# Altium schematic sheet AIL_2_Schem.SchDoc
size A4; SheetNumber: 2; SheetTotal: 2
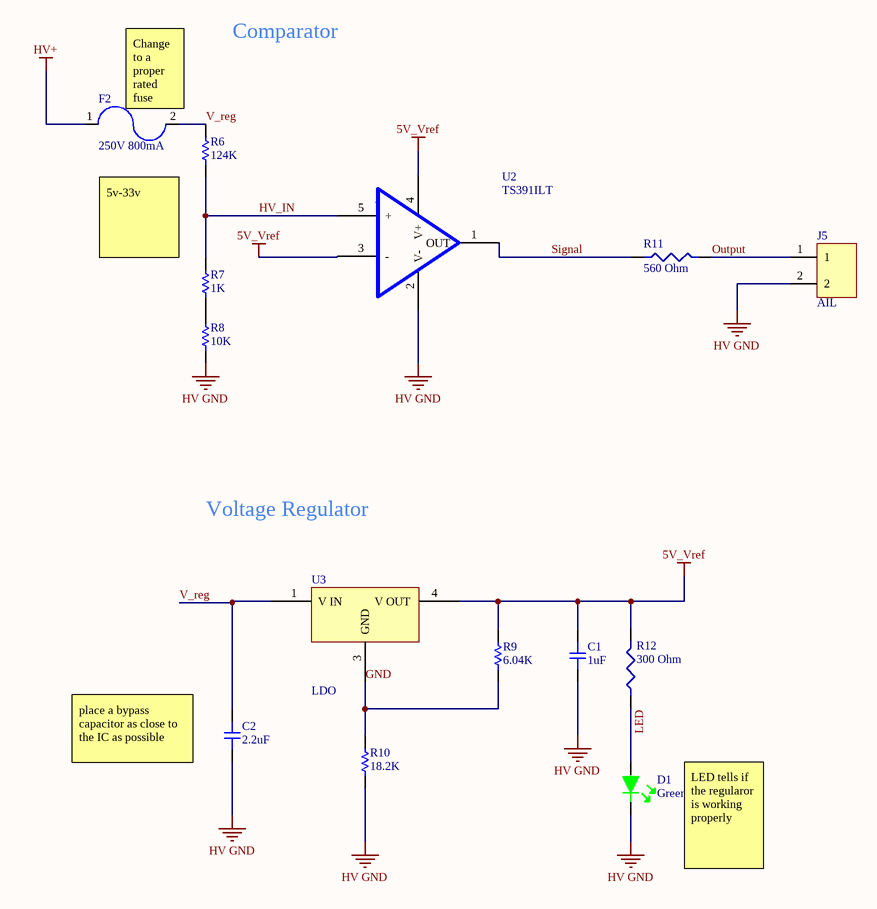
[diagram p0: AIL_2_Schem.SchDoc]

## Parts
C1  1uF  [CAP-0603]
C2  2.2uF  [CAP-2220]
D1  Green  [LED-0603]
F2  250V 800mA  [FUSE_SMD]
J5  AIL  [2PIN]
R6  124K  [RES-0603]
R7  1K  [RES-0603]
R8  10K  [RES-0603]
R9  6.04K  [RES-0603]
R10  18.2K  [RES-0603]
R11  560 Ohm  [RESC2012X06N]
R12  300 Ohm  [RESC1608X06N]
U2  TS391ILT  [SOT95P280X145-5N]
U3  LDO  [DPAK228P998X235-3N]

## Nets
5V_Vref: C1.2 R9.2 R12.2 U2.3(-) U2.4(V+) U3.4(V_OUT)
HV GND: C1.1 C2.1 D1.2 J5.2 R8.1 R10.1 U2.2(V-)
HV+: F2.1
GND: R9.1 R10.2 U3.3(GND)
HV_IN: R6.1 R7.2 U2.5(+)
LED: D1.1 R12.1
Output: J5.1 R11.2
Signal: R11.1 U2.1(OUT)
V_reg: C2.2 F2.2 R6.2 U3.1(V_IN)
NetR7_1: R7.1 R8.2

## Notes on the sheet
- Comparator
- (near F2) Change to a proper rated fuse
- 5v-33v
- Voltage Regulator
- (near C2) place a bypass capacitor as close to the IC as possible
- (near D1) LED tells if the regularor is working properly

## Library data of the parts
C1 = 0603-1uF-16V: CAP CER 1UF 16V X7R 0603; Manufacturer: KEMET; Manufacturer Part Number: C0603C105K4RACTU; Dielectric Material: Ceramic; Tolerance: 10%; Dissipation Factor: 3.5%; Supplier 1: Digi-Key; Stock 1: 600463; Pricing 1: 1=0.12, 10=0.088, 100=0.0391, 500=0.02792, 1000=0.02193 (USD); Mount: Surface Mount,PCB; Case/Package: 0603; Number of Pins: 2; Case Code (Metric): 1608; Case Code (Imperial): 0603; Contact Plating: Tin,Matte; Min Operating Temperature: -55°C; Max Operating Temperature: 125°C; Package Quantity: 4000; Capacitance: 1uF; Voltage Rating: 16V; Packaging: Tape and Reel; Voltage Rating (DC): 16V; Dielectric: X7R; Termination: SMD/SMT; Voltage: 16V; Length: 1.6mm; Height: 0.8mm; Width: 0.031inch; Thickness: 0.034inch; Depth: 0.8mm; Radiation Hardening: No; REACH SVHC: No SVHC; ComponentLink1URL: http://www.mouser.com/ds/2/212/KEM_C1002_X7R_SMD-1102033.pdf?src-supplier=Mouser; ComponentLink1Description: http://www.mouser.com/ds/2/212/KEM_C1002_X7R_SMD-1102033.pdf?src-supplier=Mouser; ComponentLink2URL: http://www.kemet.com/kemet/web/homepage/kechome.nsf/file/Commercial%20Ceramic%20Chips%20X7R%20Dielectric/$file/KEM_C1002_X7R_SMD.pdf?src-supplier=Element14; ComponentLink2Description: http://www.kemet.com/kemet/web/homepage/kechome.nsf/file/Commercial%20Ceramic%20Chips%20X7R%20Dielectric/$file/KEM_C1002_X7R_SMD.pdf?src-supplier=Element14; ComponentLink3URL: https://www.verical.com/server-webapp/html/getDatasheet?partID=385479&src-supplier=Verical; ComponentLink3Description: https://www.verical.com/server-webapp/html/getDatasheet?partID=385479&src-supplier=Verical; ComponentLink4URL: http://www.kemet.com/kemet/web/homepage/kechome.nsf/vapubfiles/KEM_C1002_X7R_SMD.pdf/$file/KEM_C1002_X7R_SMD.pdf?src-supplier=Element14; ComponentLink4Description: http://www.kemet.com/kemet/web/homepage/kechome.nsf/vapubfiles/KEM_C1002_X7R_SMD.pdf/$file/KEM_C1002_X7R_SMD.pdf?src-supplier=Element14; Supplier Part Number 1: 399-7847-6-ND
C2 = 2220-2.2uF-450V: CAP CER 2.2UF 450V X6S 2220; Manufacturer: TDK; Manufacturer Part Number: C5750X6S2W225K250KA; Tolerance: 10%; Supplier 1: Digi-Key; Stock 1: 8149; Pricing 1: 1=3.66, 10=2.957, 100=2.258 (USD); Mount: Surface Mount; Case/Package: 2220; Weight: 0.016932oz; Case Code (Metric): 5750; Case Code (Imperial): 2220; Min Operating Temperature: -55°C; Max Operating Temperature: 105°C; Package Quantity: 1; Capacitance: 2.2uF; Voltage Rating: 450V; Packaging: Tape and Reel; Dielectric: X6S; Termination: SMD/SMT; Voltage Rating (DC): 450V; Length: 5.7mm; Height: 2.5mm; Width: 0.197inch; Thickness: 0.11inch; Depth: 5mm; Radiation Hardening: No; REACH SVHC: No SVHC; Lead Free: Lead Free; ComponentLink1URL: http://product.tdk.com/capacitor/mlcc/en/documents/mlcc_commercial_midvoltage_en.pdf?src-supplier=Avnet+Europe; ComponentLink1Description: http://product.tdk.com/capacitor/mlcc/en/documents/mlcc_commercial_midvoltage_en.pdf?src-supplier=Avnet+Europe; Supplier Part Number 1: 445-7781-6-ND
D1 = LED-Green: LED GREEN CLEAR 0603 SMD; Manufacturer: Wurth Electronics; Manufacturer Part Number: 150060VS75000; Luminous Intensity: 40mcd; Viewing Angle: 140°; Forward Voltage: 2V; Wavelength: 570nm; Lens Style: Clear,Rectangular; Forward Current: 30mA; Test Current: 20mA; Supplier 1: Digi-Key; Stock 1: 118118; Pricing 1: 1=0.14, 50=0.133, 100=0.114, 500=0.099 (USD); Mount: Surface Mount; Case/Package: 0603; Number of Pins: 2; Color: Green; Case Code (Metric): 1608; Case Code (Imperial): 0603; Min Operating Temperature: -40°C; Max Operating Temperature: 85°C; Package Quantity: 1; Packaging: Tape and Reel; Dominant Wavelength: 570nm; Length: 1.6mm; Height: 0.7mm; Width: 0.8mm; REACH SVHC: Unknown; ComponentLink1URL: https://katalog.we-online.de/led/datasheet/150060VS75000.pdf?src-supplier=Digi-Key; ComponentLink1Description: https://katalog.we-online.de/led/datasheet/150060VS75000.pdf?src-supplier=Digi-Key; Supplier Part Number 1: 732-4980-1-ND
F2 = 0678D0800-02: Manufacturer: Bel; Fuse Type: Board Mount (Cartridge Style Excluded); Voltage Rating (AC): 350V; DC Cold Resistance: 380mR; Approvals: cURus; Supplier 1: Digi-Key; Manufacturer Part Number: 0678D0800-02; Stock 1: 2000; Pricing 1: 1=1.2, 5=1.164, 10=1.089, 50=0.901, 100=0.7508, 250=0.732, 500=0.61936, 1000=0.54429 (USD); Mount: Surface Mount; Case/Package: SMD/SMT; Min Operating Temperature: -55°C; Max Operating Temperature: 125°C; Packaging: Tape and Reel; Current Rating: 800mA; Voltage Rating (DC): 250V; Supplier Part Number 1: 507-2258-6-ND
J5 = 2PIN: CONN HEADER R/A 2POS 2.54MM; Manufacturer: Molex; Manufacturer Part Number: 0705530106; Number of Positions: 2; Contact Resistance: 30mR; Connector Type: Male Pin; Supplier 1: Digi-Key; Stock 1: 2224; Pricing 1: 1=1.38, 10=1.25, 100=1.071, 500=0.8925, 1000=0.765, 5000=0.6783, 10000=0.663 (USD); Mount: Through Hole; Housing Material: Polyester; Contact Plating: Gold; Contact Material: Bronze; Color: Black; Housing Color: Black; Min Operating Temperature: -40°C; Max Operating Temperature: 105°C; Number of Rows: 1; Packaging: Rail/Tube; Termination: Solder; Number of Contacts: 2; Orientation: Right Angle; Length: 7.37mm; Pitch: 2.54mm; Depth: 13.59mm; Contact Mating Length: 0.24inch; ComponentLink1URL: http://www.molex.com/webdocs/datasheets/pdf/en-us/0705530106_PCB_HEADERS.pdf?src-supplier=Avnet+Asia; ComponentLink1Description: http://www.molex.com/webdocs/datasheets/pdf/en-us/0705530106_PCB_HEADERS.pdf?src-supplier=Avnet+Asia; ComponentLink2URL: https://www.molex.com/pdm_docs/ps/PS-70400.pdf?src-supplier=Digi-Key; ComponentLink2Description: https://www.molex.com/pdm_docs/ps/PS-70400.pdf?src-supplier=Digi-Key; Supplier Part Number 1: WM4153-ND
R6 = 0603-124KR: RES 124K OHM 1% 1/10W 0603; Manufacturer: Stackpole Electronics; Manufacturer Part Number: RMCF0603FT124K; Resistance: 124kR; Max Power Dissipation: 100mW; Temperature Coefficient: 100ppm/°C; Supplier 1: Digi-Key; Stock 1: 39767; Pricing 1: 1=0.1, 10=0.016, 100=0.0065, 1000=0.00292, 2500=0.00253 (USD); Mount: Surface Mount; Case/Package: 0603; Case Code (Metric): 1608; Case Code (Imperial): 0603; Contact Plating: Tin,Matte; Min Operating Temperature: -55°C; Max Operating Temperature: 155°C; Tolerance: 1%; Packaging: Tape and Reel; Composition: Thick Film; Number of Terminations: 2; Military Standard: Not; Features: Automotive AEC-Q200; Length: 0.061inch; Height: 0.022inch; Width: 0.031inch; Depth: 0.8mm; Radiation Hardening: No; ComponentLink1URL: https://www.seielect.com/Catalog/SEI-RMCF_RMCP.pdf?src-supplier=Digi-Key; ComponentLink1Description: https://www.seielect.com/Catalog/SEI-RMCF_RMCP.pdf?src-supplier=Digi-Key; ComponentLink2URL: https://www.seielect.com/catalog/SEI-Packaging.pdf?src-supplier=Digi-Key; ComponentLink2Description: https://www.seielect.com/catalog/SEI-Packaging.pdf?src-supplier=Digi-Key; ComponentLink3URL: https://www.verical.com/server-webapp/html/getDatasheet?partID=371756&src-supplier=Verical; ComponentLink3Description: https://www.verical.com/server-webapp/html/getDatasheet?partID=371756&src-supplier=Verical; ComponentLink4URL: http://components.arrow.com/part/dataview/40961222S9798425N1174?src-supplier=Arrow; ComponentLink4Description: http://components.arrow.com/part/dataview/40961222S9798425N1174?src-supplier=Arrow; ComponentLink5URL: https://www.seielect.com/catalog/SEI-RMCF_RMCP.pdf?src-supplier=Avnet; ComponentLink5Description: https://www.seielect.com/catalog/SEI-RMCF_RMCP.pdf?src-supplier=Avnet; Supplier Part Number 1: RMCF0603FT124KDKR-ND
R7 = 0603-1KR: RES SMD 1K OHM 1% 1/10W 0603; Manufacturer: Vishay Dale; Manufacturer Part Number: CRCW06031K00FKEA; Resistance: 1kR; Power Rating: 100mW; Voltage Rating: 75V; Temperature Coefficient: 100ppm/°C; Supplier 1: Digi-Key; Stock 1: 671453; Pricing 1: 1=0.1, 10=0.034, 100=0.0139, 1000=0.00623, 2500=0.0054 (USD); Mount: Surface Mount; Case/Package: 0603; Number of Pins: 2; Weight: 7.1E-05oz; Case Code (Metric): 1608; Case Code (Imperial): 0603; Contact Plating: Tin; Min Operating Temperature: -55°C; Max Operating Temperature: 155°C; Composition: Thick Film; Tolerance: 1%; Packaging: Tape and Reel; Package Quantity: 10; Number of Terminations: 2; Termination: SMD/SMT; Military Standard: Not; Max Power Dissipation: 100mW; Voltage Rating (DC): 75V; Features: Automotive AEC-Q200; Length: 1.55mm; Height: 0.45mm; Width: 0.033inch; Depth: 0.85mm; Radiation Hardening: No; REACH SVHC: Unknown; Lead Free: Lead Free; ComponentLink1URL: http://www.vishay.com/docs/20035/dcrcwe3.pdf?src-supplier=Digi-Key; ComponentLink1Description: http://www.vishay.com/docs/20035/dcrcwe3.pdf?src-supplier=Digi-Key; ComponentLink2URL: http://uk.rs-online.com/webdocs/0d98/0900766b80d98afc.pdf?src-supplier=RSComponents; ComponentLink2Description: http://uk.rs-online.com/webdocs/0d98/0900766b80d98afc.pdf?src-supplier=RSComponents; ComponentLink3URL: http://www.vishay.com/docs/20035/dcrcwe3.pdf?src-supplier=Avnet; ComponentLink3Description: http://www.vishay.com/docs/20035/dcrcwe3.pdf?src-supplier=Avnet; ComponentLink4URL: http://www.vishay.com/docs/20035/dcrcwe3.pdf?src-supplier=Avnet+Asia; ComponentLink4Description: http://www.vishay.com/docs/20035/dcrcwe3.pdf?src-supplier=Avnet+Asia; ComponentLink5URL: http://www.farnell.com/datasheets/2310790.pdf?src-supplier=Element14; ComponentLink5Description: http://www.farnell.com/datasheets/2310790.pdf?src-supplier=Element14; ComponentLink6URL: https://www.distrelec.biz/Web/Downloads/a_/en/flD-CRCW-e3_data_en.pdf?mime=application%2Fpdf&src-supplier=Distrelec; ComponentLink6Description: https://www.distrelec.biz/Web/Downloads/a_/en/flD-CRCW-e3_data_en.pdf?mime=application%2Fpdf&src-supplier=Distrelec; ComponentLink7URL: http://www.vishay.com/docs/20035/dcrcwe3.pdf?src-supplier=Future+Electronics; ComponentLink7Description: http://www.vishay.com/docs/20035/dcrcwe3.pdf?src-supplier=Future+Electronics; ComponentLink8URL: http://www.vishay.com/docs/20035/dcrcwe3.pdf?src-supplier=Avnet+Europe; ComponentLink8Description: http://www.vishay.com/docs/20035/dcrcwe3.pdf?src-supplier=Avnet+Europe; Supplier Part Number 1: 541-1.00KHCT-ND
R8 = 0603-10KR: RES SMD 10K OHM 5% 1/10W 0603; Manufacturer: Yageo; Manufacturer Part Number: RC0603JR-0710KL; Resistance: 10kR; Voltage Rating (DC): 50V; Temperature Coefficient: 100ppm/°C; Power Rating: 100mW; Supplier 1: Digi-Key; Stock 1: 3006558; Pricing 1: 1=0.1, 10=0.019, 100=0.0077, 1000=0.00347, 2500=0.00301 (USD); Case/Package: 0603; Number of Pins: 2; Contact Plating: Tin,Matte; Case Code (Imperial): 0603; Case Code (Metric): 1608; Min Operating Temperature: -55°C; Max Operating Temperature: 155°C; Packaging: Tape and Reel; Tolerance: 5%; Composition: Thick Film; Voltage Rating: 50V; Termination: SMD/SMT; Military Standard: Not; Features: Moisture Resistant; Max Power Dissipation: 100mW; Number of Terminations: 2; Length: 0.063inch; Width: 0.031inch; Depth: 0.8mm; Height - Seated (Max): 0.022inch; Radiation Hardening: No; REACH SVHC: Unknown; Lead Free: Lead Free; ComponentLink1URL: http://www.yageo.com/documents/recent/PYu-RC_Group_51_RoHS_L_10.pdf?src-supplier=Digi-Key; ComponentLink1Description: http://www.yageo.com/documents/recent/PYu-RC_Group_51_RoHS_L_10.pdf?src-supplier=Digi-Key; Supplier Part Number 1: 311-10KGRDKR-ND
R9 = 0603-6.04KR: RES 6.04K OHM 1% 1/10W 0603; Manufacturer: Stackpole Electronics; Manufacturer Part Number: RMCF0603FT6K04; Resistance: 6.04kR; Power Rating: 100mW; Temperature Coefficient: 100ppm/°C; Supplier 1: Digi-Key; Stock 1: 57211; Pricing 1: 1=0.1, 10=0.016, 100=0.0065, 1000=0.00292, 2500=0.00253 (USD); Mount: Surface Mount; Case/Package: 0603; Case Code (Metric): 1608; Case Code (Imperial): 0603; Contact Plating: Tin,Matte; Min Operating Temperature: -55°C; Max Operating Temperature: 155°C; Packaging: Tape and Reel; Tolerance: 1%; Composition: Thick Film; Number of Terminations: 2; Max Power Dissipation: 100mW; Features: Automotive AEC-Q200; Length: 0.061inch; Height: 0.022inch; Width: 0.031inch; Radiation Hardening: No; Lead Free: Lead Free; ComponentLink1URL: https://www.seielect.com/catalog/SEI-RMCF_RMCP.pdf?src-supplier=Avnet; ComponentLink1Description: https://www.seielect.com/catalog/SEI-RMCF_RMCP.pdf?src-supplier=Avnet; ComponentLink2URL: https://www.seielect.com/catalog/SEI-Packaging.pdf?src-supplier=Digi-Key; ComponentLink2Description: https://www.seielect.com/catalog/SEI-Packaging.pdf?src-supplier=Digi-Key; ComponentLink3URL: http://www.seielect.com/Catalog/SEI-RMC.pdf?src-supplier=Future+Electronics; ComponentLink3Description: http://www.seielect.com/Catalog/SEI-RMC.pdf?src-supplier=Future+Electronics; ComponentLink4URL: http://components.arrow.com/part/dataview/44987894S7815445N1174?src-supplier=Arrow; ComponentLink4Description: http://components.arrow.com/part/dataview/44987894S7815445N1174?src-supplier=Arrow; ComponentLink5URL: https://www.seielect.com/catalog/SEI-RMCF_RMCP.pdf?src-supplier=Avnet+Asia; ComponentLink5Description: https://www.seielect.com/catalog/SEI-RMCF_RMCP.pdf?src-supplier=Avnet+Asia; Supplier Part Number 1: RMCF0603FT6K04DKR-ND
R10 = 0603-18.2KR: RES 18.2K OHM 1% 1/10W 0603; Manufacturer: Stackpole Electronics; Manufacturer Part Number: RMCF0603FT18K2; Resistance: 18.2kR; Power Rating: 100mW; Temperature Coefficient: 100ppm/°C; Supplier 1: Digi-Key; Stock 1: 140267; Pricing 1: 1=0.1, 10=0.016, 100=0.0065, 1000=0.00292, 2500=0.00253 (USD); Mount: Surface Mount; Case/Package: 0603; Case Code (Metric): 1608; Case Code (Imperial): 0603; Contact Plating: Tin,Matte; Min Operating Temperature: -55°C; Max Operating Temperature: 155°C; Packaging: Tape and Reel; Tolerance: 1%; Composition: Thick Film; Number of Terminations: 2; Max Power Dissipation: 100mW; Features: Automotive AEC-Q200; Length: 0.061inch; Height: 0.022inch; Width: 0.031inch; Radiation Hardening: No; Lead Free: Lead Free; ComponentLink1URL: https://www.seielect.com/catalog/SEI-RMCF_RMCP.pdf?src-supplier=Avnet; ComponentLink1Description: https://www.seielect.com/catalog/SEI-RMCF_RMCP.pdf?src-supplier=Avnet; ComponentLink2URL: http://www.seielect.com/Catalog/SEI-RMC.pdf?src-supplier=Future+Electronics; ComponentLink2Description: http://www.seielect.com/Catalog/SEI-RMC.pdf?src-supplier=Future+Electronics; ComponentLink3URL: http://components.arrow.com/part/dataview/50570316S154854N1174?src-supplier=Arrow; ComponentLink3Description: http://components.arrow.com/part/dataview/50570316S154854N1174?src-supplier=Arrow; ComponentLink4URL: https://www.seielect.com/Catalog/SEI-RMCF_RMCP.pdf?src-supplier=Digi-Key; ComponentLink4Description: https://www.seielect.com/Catalog/SEI-RMCF_RMCP.pdf?src-supplier=Digi-Key; ComponentLink5URL: https://www.seielect.com/catalog/SEI-Packaging.pdf?src-supplier=Digi-Key; ComponentLink5Description: https://www.seielect.com/catalog/SEI-Packaging.pdf?src-supplier=Digi-Key; Supplier Part Number 1: RMCF0603FT18K2DKR-ND
R11 = ESR10EZPJ561: RES SMD 560 OHM 5% 0.4W 0805; Manufacturer: Rohm; Resistance: 560R; Power Rating: 250mW; Temperature Coefficient: 200ppm/°C; Max Power Dissipation: 400mW; Supplier 1: Digi-Key; Manufacturer Part Number: ESR10EZPJ561; Stock 1: 10361; Pricing 1: 1=0.1, 10=0.083, 100=0.0318, 1000=0.01398, 2500=0.01207 (USD); Case/Package: 0805; Case Code (Metric): 2012; Case Code (Imperial): 0805; Min Operating Temperature: -55°C; Max Operating Temperature: 155°C; Tolerance: 5%; Package Quantity: 1; Packaging: Tape and Reel; Composition: Thick Film; Number of Terminations: 2; Features: Automotive AEC-Q200; Length: 0.079inch; Height: 0.026inch; Width: 0.049inch; Lead Free: Lead Free; ComponentLink1URL: http://www.rohm.com/web/global/datasheet/ESR01MZPF/esr-e?src-supplier=Digi-Key; ComponentLink1Description: http://www.rohm.com/web/global/datasheet/ESR01MZPF/esr-e?src-supplier=Digi-Key; ComponentLink2URL: https://www.rohm.com/datasheet/ESR01MZPF/esr-e?src-supplier=Digi-Key; ComponentLink2Description: https://www.rohm.com/datasheet/ESR01MZPF/esr-e?src-supplier=Digi-Key; ComponentLink3URL: http://www1.futureelectronics.com/doc/ROHM%20SEMICONDUCTOR/ESR10EZPD.pdf?src-supplier=Future+Electronics; ComponentLink3Description: http://www1.futureelectronics.com/doc/ROHM%20SEMICONDUCTOR/ESR10EZPD.pdf?src-supplier=Future+Electronics; Supplier Part Number 1: RHM560KDKR-ND
R12 = RR0816P-301-D: RES SMD 300 OHM 0.5% 1/16W 0603; Manufacturer: Susumu; Resistance: 300R; Power Rating: 63mW; Voltage Rating: 75V; Temperature Coefficient: 25ppm/°C; Supplier 1: Digi-Key; Manufacturer Part Number: RR0816P-301-D; Stock 1: 26864; Pricing 1: 1=0.11, 10=0.098, 100=0.0376, 1000=0.01654, 2500=0.01428 (USD); Case/Package: 0603; Number of Pins: 2; Case Code (Imperial): 0603; Case Code (Metric): 1608; Min Operating Temperature: -55°C; Max Operating Temperature: 125°C; Packaging: Tape and Reel; Tolerance: 0.5%; Package Quantity: 5000; Termination: SMD/SMT; Composition: Thin Film; Number of Terminations: 2; Max Power Dissipation: 63mW; Voltage Rating (DC): 75V; Length: 1.6mm; Height: 0.4mm; Width: 0.8mm; Depth: 0.8mm; REACH SVHC: Unknown; Lead Free: Lead Free; ComponentLink1URL: http://www.susumu.co.jp/common/pdf/n_catalog_partition05_en.pdf?src-supplier=Digi-Key; ComponentLink1Description: http://www.susumu.co.jp/common/pdf/n_catalog_partition05_en.pdf?src-supplier=Digi-Key; Supplier Part Number 1: RR08P300DCT-ND
U2 = TS391ILT: COMPARATOR, SINGLE, MICROPWR, 5SOT23; Manufacturer: STMicroelectronics; Voltage Gain: 106.02dB; Min Supply Voltage: 2V; Max Supply Voltage: 36V; Min Dual Supply Voltage: 1V; Max Dual Supply Voltage: 18V; Max Power Dissipation: 500mW; Nominal Supply Current: 500uA; Number of Channels: 1; Dual Supply Voltage: 9V; Input Bias Current: 250nA; Output Current per Channel: 100pA; Input Offset Voltage (Vos): 5mV; Response Time: 1.3us; Output Current: 16mA; Quiescent Current: 1.25mA; Natural Thermal Resistance: 250°C/W; Output Type: TTL; Supplier 1: Digi-Key; Manufacturer Part Number: TS391ILT; Stock 1: 45214; Pricing 1: 1=0.58, 10=0.508, 25=0.4776, 100=0.3621, 250=0.3082, 500=0.29278, 1000=0.22343 (USD); Mount: Surface Mount; Case/Package: SOT-23; Number of Pins: 5; Weight: 0.01lb; Contact Plating: Tin,Matte; Min Operating Temperature: -40°C; Max Operating Temperature: 125°C; Packaging: Tape and Reel; Package Quantity: 3000; Number of Elements: 1; Max Supply Current: 500uA; Max Input Current: 250nA; Power Dissipation: 500mW; Type: General Purpose; Length: 3mm; Height: 1.3mm; Width: 1.75mm; Radiation Hardening: No; REACH SVHC: No SVHC; Lead Free: Lead Free; ComponentLink1URL: http://www.farnell.com/datasheets/1674516.pdf?src-supplier=Element14; ComponentLink1Description: http://www.farnell.com/datasheets/1674516.pdf?src-supplier=Element14; ComponentLink2URL: http://www.mouser.com/ds/2/389/ts391-957414.pdf?src-supplier=Mouser; ComponentLink2Description: http://www.mouser.com/ds/2/389/ts391-957414.pdf?src-supplier=Mouser; ComponentLink3URL: https://www.verical.com/server-webapp/html/getDatasheet?partID=142259&src-supplier=Verical; ComponentLink3Description: https://www.verical.com/server-webapp/html/getDatasheet?partID=142259&src-supplier=Verical; ComponentLink4URL: http://www.st.com/web/en/resource/technical/document/datasheet/CD00001660.pdf?src-supplier=Future+Electronics; ComponentLink4Description: http://www.st.com/web/en/resource/technical/document/datasheet/CD00001660.pdf?src-supplier=Future+Electronics; ComponentLink5URL: http://www.st.com/content/ccc/resource/technical/document/datasheet/de/4c/b3/3d/64/7d/48/8e/CD00001660.pdf/files/CD00001660.pdf/jcr:content/translations/en.CD00001660.pdf?src-supplier=Digi-Key; ComponentLink5Description: http://www.st.com/content/ccc/resource/technical/document/datasheet/de/4c/b3/3d/64/7d/48/8e/CD00001660.pdf/files/CD00001660.pdf/jcr:content/translations/en.CD00001660.pdf?src-supplier=Digi-Key; ComponentLink6URL: http://datasheet.iiic.cc/stmicroelectronics/TS391ILT.pdf?src-supplier=IIIC; ComponentLink6Description: http://datasheet.iiic.cc/stmicroelectronics/TS391ILT.pdf?src-supplier=IIIC; Supplier Part Number 1: 497-2275-1-ND
U3 = LR8K4-G: Standard Regulator Pos 1.2V to 440V 0.01A 3-Pin(2+Tab) TO-252; Manufacturer: Microchip; Max Power Dissipation: 2.5W; Max Input Voltage: 450V; Min Input Voltage: 13.2V; Number of Outputs: 1; Polarity: Positive; Output Current: 20mA; Accuracy: 5%; Power Supply Rejection Ratio (PSRR): 60dB; Output Type: Adjustable; Max Output Current: 10mA; Min Current Limit: 30mA; Dropout Voltage: 450mV; Supplier 1: Digi-Key; Manufacturer Part Number: LR8K4-G; Stock 1: 11899; Pricing 1: 1=0.93, 25=0.78, 100=0.71 (USD); Mount: Surface Mount; Case/Package: TO-252-3; Number of Pins: 3; Contact Plating: Tin,Matte; Min Operating Temperature: -40°C; Max Operating Temperature: 85°C; Output Voltage: 440V; Packaging: Cut Tape; Package Quantity: 2000; Number of Regulators: 1; Min Output Voltage: 1.2V; Max Output Voltage: 440V; Length: 6.73mm; Height: 2.39mm; Width: 6.1mm; Radiation Hardening: No; REACH SVHC: No SVHC; Lead Free: Lead Free; ComponentLink1URL: http://www.farnell.com/datasheets/1849628.pdf?src-supplier=Element14; ComponentLink1Description: http://www.farnell.com/datasheets/1849628.pdf?src-supplier=Element14; Supplier Part Number 1: LR8K4-GCT-ND